# EAGLE design FindMe_Tag (EAGLE 9.0.1)

## Sheet 1 of 2
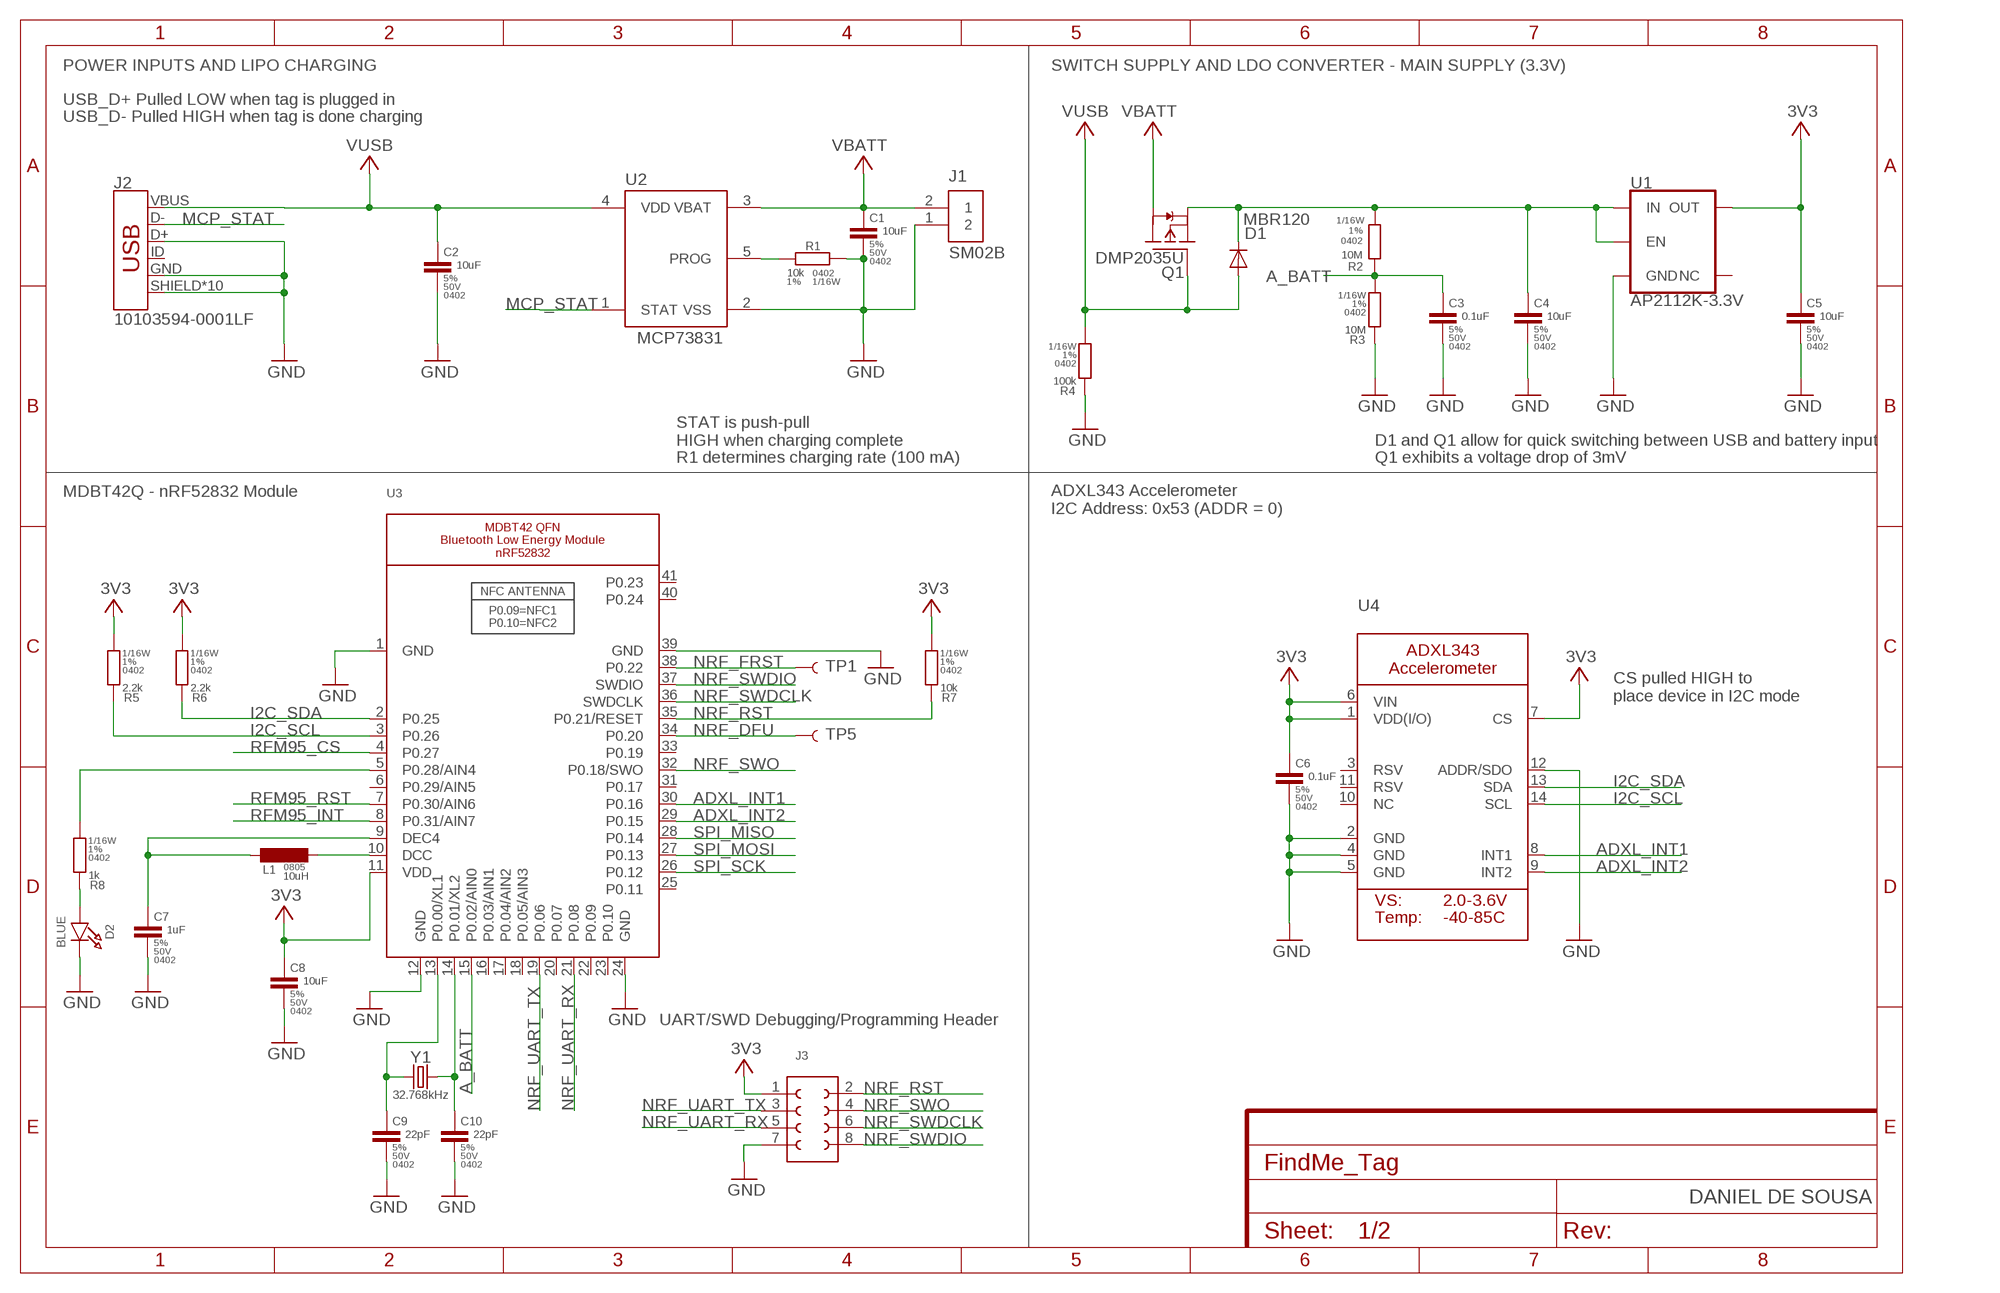
[diagram p0: schematic, sheet 1]

### Parts
C1  10uF  C-EUC0402_MURATA_GRM15-GJM15  [C0402_MURATA_GRM15-GJM15]
C2  10uF  C-EUC0402_MURATA_GRM15-GJM15  [C0402_MURATA_GRM15-GJM15]
C3  0.1uF  C-EUC0402_MURATA_GRM15-GJM15  [C0402_MURATA_GRM15-GJM15]
C4  10uF  C-EUC0402_MURATA_GRM15-GJM15  [C0402_MURATA_GRM15-GJM15]
C5  10uF  C-EUC0402_MURATA_GRM15-GJM15  [C0402_MURATA_GRM15-GJM15]
C6  0.1uF  C-EUC0402_MURATA_GRM15-GJM15  [C0402_MURATA_GRM15-GJM15]
C7  1uF  C-EUC0402_MURATA_GRM15-GJM15  [C0402_MURATA_GRM15-GJM15]
C8  10uF  C-EUC0402_MURATA_GRM15-GJM15  [C0402_MURATA_GRM15-GJM15]
C9  22pF  C-EUC0402_MURATA_GRM15-GJM15  [C0402_MURATA_GRM15-GJM15]
C10  22pF  C-EUC0402_MURATA_GRM15-GJM15  [C0402_MURATA_GRM15-GJM15]
D1  MBR120  AS-ITM-00111  [SOD-123FL]
D2  BLUE  LED0805_NOOUTLINE  [CHIPLED_0805_NOOUTLINE]
J1  SM02B  AS-ITM-00231  [JST_SH_2X1]
J2  10103594-0001LF  USB_MICRO-B_HALF_PTH_MILL  [USB-MICROB-PTH-MILL]
J3  610X08243021  [610X08243021]
L1  10uH  LQM21PN1R0MC0D  [L0805_MURATA_LQM21]
Q1  DMP2035U  AS-ITM-00024  [SOT23]
R1  10k  CRCW040210K0FKED  [R0402_VISHAY_CRCW0402]
R2  10M  CRCW04021M00FKED  [R0402_VISHAY_CRCW0402]
R3  10M  CRCW04021M00FKED  [R0402_VISHAY_CRCW0402]
R4  100k  CRCW04021M00FKED  [R0402_VISHAY_CRCW0402]
R5  2.2k  CRCW040210K0FKED  [R0402_VISHAY_CRCW0402]
R6  2.2k  CRCW040210K0FKED  [R0402_VISHAY_CRCW0402]
R7  10k  CRCW040210K0FKED  [R0402_VISHAY_CRCW0402]
R8  1k  CRCW040210K0FKED  [R0402_VISHAY_CRCW0402]
TP1  TEST-POINT3  [PAD.03X.03]
TP5  TEST-POINT3  [PAD.03X.03]
U1  AP2112K-3.3V  V_REG_AP2112K-3.3V  [SOT23-5]
U2  MCP73831  AS-ITM-00136  [SOT-23]
U3  NRF52832_MODULE_MDBT42  [BLE_MODULE_RAYTAC_MDBT42]
U4  ACCEL_ADXL343  [LGA14]
Y1  32.768kHz  CRYSTAL-32.768KHZSMD-3.2X1.5  [CRYSTAL-SMD-3.2X1.5MM]

### Nets
+3V3: C5.1 C6.1 C8.1 J3.1 R5.2 R6.2 R7.2 U1.5(OUT) U3.11(VDD) U4.1(VDD(I/O)) U4.6(VIN) U4.7(CS) ; supply symbol labelled 3V3 ; also sheet 2
A_BATT: C3.1 R2.1 R3.2 U3.15(P0.02/AIN0)
ADXL_INT1: U3.30(P0.16) U4.8(INT1)
ADXL_INT2: U3.29(P0.15) U4.9(INT2)
GND: C1.2 C2.2 C3.2 C4.2 C5.2 C6.2 C7.2 C8.2 C9.2 C10.2 D2.C J1.1 J2.D+ J2.GND J2.SHIELD J2.SHIELD2(SHIELD) J2.SHIELD3(SHIELD) J2.SHIELD4(SHIELD) J2.SHIELD5(SHIELD) J2.SHIELD6(SHIELD) J2.SHIELD7(SHIELD) J2.SHIELD8(SHIELD) J2.SHIELD9(SHIELD) J2.SHIELD10(SHIELD) J3.7 R1.1 R3.1 R4.1 U1.2(GND) U2.2(VSS) U3.1(GND) U3.12(GND) U3.24(GND) U3.39(GND) U4.2(GND) U4.4(GND) U4.5(GND) U4.12(ADDR/SDO) ; also sheet 2
I2C_SCL: R5.1 U3.3(P0.26) U4.14(SCL) ; also sheet 2
I2C_SDA: R6.1 U3.2(P0.25) U4.13(SDA) ; also sheet 2
MCP_STAT: J2.D- U2.1(STAT)
N$2: R1.2 U2.5(PROG)
N$3: C4.1 D1.C Q1.E(S) R2.2 U1.1(IN) U1.3(EN)
N$5: C9.1 U3.13(P0.00/XL1) Y1.P$1
N$6: C10.1 U3.14(P0.01/XL2) Y1.P$2
N$7: L1.P$2 U3.10(DCC)
N$11: C7.1 L1.P$1 U3.9(DEC4)
N$12: R8.2 U3.5(P0.28/AIN4)
N$18: D2.A R8.1
NRF_DFU: TP5.P$1 U3.34(P0.20)
NRF_FRST: TP1.P$1 U3.38(P0.22)
NRF_RST: J3.2 R7.1 U3.35(P0.21/RESET)
NRF_SWDCLK: J3.6 U3.36(SWDCLK)
NRF_SWDIO: J3.8 U3.37(SWDIO)
NRF_SWO: J3.4 U3.32(P0.18/SWO)
NRF_UART_RX: J3.5 U3.21(P0.08)
NRF_UART_TX: J3.3 U3.19(P0.06)
RFM95_CS: U3.4(P0.27) ; also sheet 2
RFM95_INT: U3.8(P0.31/AIN7) ; also sheet 2
RFM95_RST: U3.7(P0.30/AIN6) ; also sheet 2
SPI_MISO: U3.28(P0.14) ; also sheet 2
SPI_MOSI: U3.27(P0.13) ; also sheet 2
SPI_SCK: U3.26(P0.12) ; also sheet 2
VBATT: C1.1 J1.2 Q1.C(D) U2.3(VBAT)
VUSB: C2.1 D1.A J2.VBUS Q1.B(G) R4.2 U2.4(VDD)
Unconnected: J2.ID U1.4(NC) U3.6(P0.29/AIN5) U3.16(P0.03/AIN1) U3.17(P0.04/AIN2) U3.18(P0.05/AIN3) U3.20(P0.07) U3.22(P0.09) U3.23(P0.10) U3.25(P0.11) U3.31(P0.17) U3.33(P0.19) U3.40(P0.24) U3.41(P0.23) U4.3(RSV) U4.10(NC) U4.11(RSV)

### Notes on the sheet
- POWER INPUTS AND LIPO CHARGING | SWITCH SUPPLY AND LDO CONVERTER - MAIN SUPPLY (3.3V)
- USB_D+ Pulled LOW when tag is plugged in
- USB_D- Pulled HIGH when tag is done charging
- STAT is push-pull
  HIGH when charging complete
- D1 and Q1 allow for quick switching between USB and battery input
- R1 determines charging rate (100 mA) | Q1 exhibits a voltage drop of 3mV
- MDBT42Q - nRF52832 Module
- ADXL343 Accelerometer
  I2C Address: 0x53 (ADDR = 0)
- CS pulled HIGH to 
  place device in I2C mode
- UART/SWD Debugging/Programming Header
- DANIEL DE SOUSA

## Sheet 2 of 2
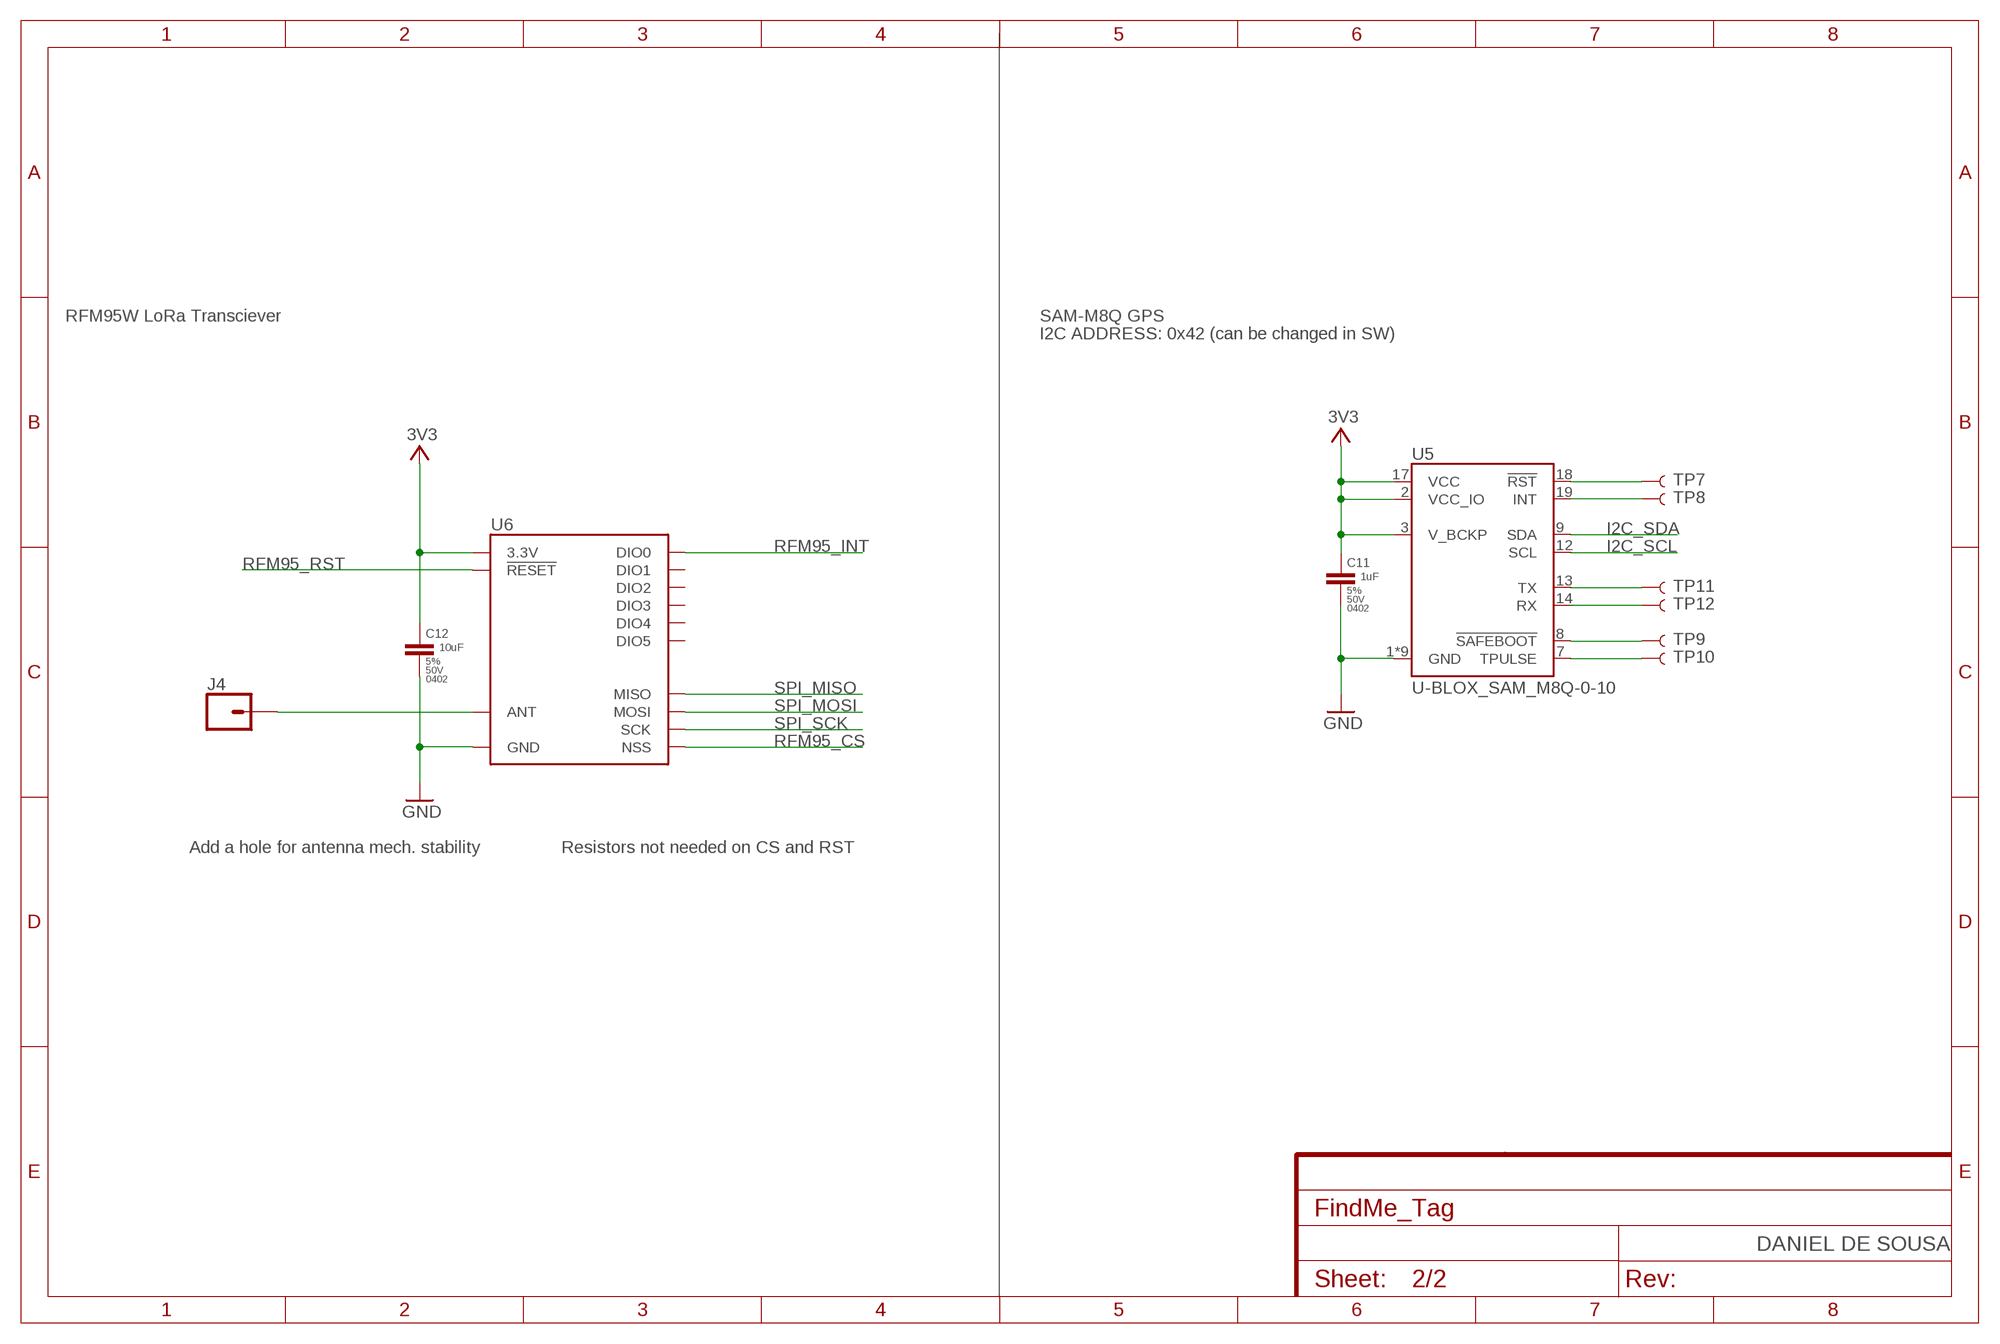
[diagram p1: schematic, sheet 2]

### Parts
C11  1uF  C-EUC0402_MURATA_GRM15-GJM15  [C0402_MURATA_GRM15-GJM15]
C12  10uF  C-EUC0402_MURATA_GRM15-GJM15  [C0402_MURATA_GRM15-GJM15]
J4  CONN_01PTH_NO_SILK_YES_STOP  [1X01_NO_SILK]
TP7  TEST-POINT3  [PAD.03X.03]
TP8  TEST-POINT3  [PAD.03X.03]
TP9  TEST-POINT3  [PAD.03X.03]
TP10  TEST-POINT3  [PAD.03X.03]
TP11  TEST-POINT3  [PAD.03X.03]
TP12  TEST-POINT3  [PAD.03X.03]
U5  U-BLOX_SAM_M8Q-0-10  [SAM-M8Q]
U6  RFM95W  [RFM95/96/97/98W]

### Nets
+3V3: C11.1 C12.1 U5.2(VCC_IO) U5.3(V_BCKP) U5.17(VCC) U6.3.3V ; supply symbol labelled 3V3 ; also sheet 1
GND: C11.2 C12.2 U5.1(GND) U5.4(GND) U5.5(GND) U5.6(GND) U5.10(GND) U5.11(GND) U5.15(GND) U5.16(GND) U5.20(GND) U6.GND@1(GND) U6.GND@2(GND) U6.GND@3(GND) ; also sheet 1
I2C_SCL: U5.12(SCL) ; also sheet 1
I2C_SDA: U5.9(SDA) ; also sheet 1
N$1: J4.1 U6.ANT
N$4: TP7.P$1 U5.18(!RST)
N$8: TP8.P$1 U5.19(INT)
N$9: TP9.P$1 U5.8(!SAFEBOOT)
N$10: TP10.P$1 U5.7(TPULSE)
N$13: TP11.P$1 U5.13(TX)
N$14: TP12.P$1 U5.14(RX)
RFM95_CS: U6.NSS ; also sheet 1
RFM95_INT: U6.DIO0 ; also sheet 1
RFM95_RST: U6.!RESET ; also sheet 1
SPI_MISO: U6.MISO ; also sheet 1
SPI_MOSI: U6.MOSI ; also sheet 1
SPI_SCK: U6.SCK ; also sheet 1
Unconnected: U6.DIO1 U6.DIO2 U6.DIO3 U6.DIO4 U6.DIO5

### Notes on the sheet
- RFM95W LoRa Transciever | SAM-M8Q GPS
- I2C ADDRESS: 0x42 (can be changed in SW)
- Add a hole for antenna mech. stability | Resistors not needed on CS and RST
- DANIEL DE SOUSA

## Library data of the parts
C1-C12 = CAPACITOR:C-EU: CAPACITOR, European symbol; PACKAGE: 0402; RATING: 50V; TOLERANCE: 5%
D1 = tinycircuits:AS-ITM-00111: DIODE SCHOTTKY 20V 1A SOD123L; PARTNO: AS-ITM-00111; PNPROTATION: 0; VALUE: MBR120VLSFT1G
D2 = microbuilder:LED: LED 0603 - 0603 Surface Mount Package 2mA: Green LED - Low Power (3.9mcd, 2ma, 1.7Vf) - Digikey: 475-2709-2-ND Orange LED - Low Power (9.8mcd, 2ma, 1.8Vf) - Digikey: 475-1194-2-ND Red LED - Low Power (5mcd, 2ma, 1.8Vf) - Digikey: 475-1195-2-ND Yellow LED - Low Power (7mcd, 2ma, 1.8Vf) - Digikey: 475-1196-2-ND 5mA: Blue LED - Low Power (17mcd, 5ma, 2.9Vf) - Digikey: LNJ937W8CRACT-ND 0805 - 0805 Surface Mount Package 2mA: Red LED (8.8mcd, 2mA, 1.8Vf, Clear) - Low Power [Digikey: 475-2510-1-ND] Green LED (5mcd, 2mA, 1.8Vf, Clear) - Low Power [Digikey: 475-2730-1-ND] Yellow LED (11.3mcd, 2mA, 1.8Vf, Clear) - Low Power [Digikey: 475-2555-1-ND] 20mA: Red LED (104mcd, 20mA, Diffused) - LS R976 [Digikey: 475-1278-6-ND] Red LED (12mcd, 20mA, 2.0Vf, Clear) - APT2012EC [Digikey: 754-1128-1-ND] Green LED (15mcd, 20mA, 2.2Vf, Clear) - APT2012GC [Digikey: 754-1131-1-ND] Orange LED (160mcd, 20mA, 2.1Vf, Clear) - APT2012SECK [Digikey: 754-1130-1-ND] 1206 - 1206 Surface Mount Package Green LED (26mcd, 20mA, Diffused) - LG N971 [Digikey: 475-1407-6-ND] Red LED (15mcd, 20mA, Diffused) - LH N974 [Digikey: 475-1416-6-ND] Cree - Cree High-Power Surface Mount LEDs XPEBWT-L1-0000-00D50 - White 111lm 350mA 2.9Vf 6200K 110° XTEAWT-00-0000-00000LEE3 - White 114lm 350mA 2.85Vf 5000K 115° Everlight - Everlight 45-21 Series Surface Mount LEDs 45-21/QK2C-B2832AC2CB2/2T - Warm White 2000mcd 20mA 3.25Vf 3050K 120° 45-21/LK2C-B38452C4CB2/2T - Nuetral White 2000mcd 20mA 3.25Vf 4150K 120° 45-21/LK2C-B50634C6CB2/2T - Cold White 2200mcd 20mA 3.25Vf 5650K 120° PLCC2 Reverse Mount LS T77K-J1L2-1-0-2-R18-Z - Red 11.25mcd 2mA 1.8Vf 630nm 120° LO T77K-L1M2-24-Z - Orange 19.6mcd 2mA 1.8Vf 606nm 120° LY T77K-K2M1-26-Z - Yellow 15.7mcd 2mA 1.8Vf 587nm 120°
J1 = tinycircuits:AS-ITM-00231: CONN HEADER SH 2POS SIDE 1MM; PARTNO: AS-ITM-00231; PNPROTATION: 180; VALUE: SM02B-SRSS-TB(LF)(SN)
J2 = SparkFun-Connectors:USB_MICRO-B: USB Type Micro-B Connector Male/female and PTH/SMT variants SparkFun Products: SparkFun microB USB Breakout <https://www.sparkfun.com/products/12035> SparkFun USB microB Plug Breakout <https://www.sparkfun.com/products/10031> SparkFun ESP8266 Thing <https://www.sparkfun.com/products/13231>; PROD_ID: CONN-13711
J3 = Board-to-Board (rev18a):610X08243021: WR-PHD 2.54mm SMT Dual Socket Header Bottom Entry, 8 Pins=>Code : Con_BTB_SHD_2.54_2_610x08243021(packageing:x = 0: Tube x = 3: Tape & Reel with Cap) <http://katalog.we-online.de/media/images/eican/Con_BTB_SHD_2.54_2_6100xx243021_pf2.jpg> Details see: 6100xx243021 http://katalog.we-online.de/en/em/PHD_2_54_SMT_DUAL_SOCKET_HEADER_BOTTOM_ENTRY_6100XX243021 6103xx243021 http://katalog.we-online.de/en/em/PHD_2_54_SMT_DUAL_SOCKET_HEADER_BOTTOM_ENTRY_6103XX243021 2014 (C) Würth Elektronik
J4 = SparkFun-Connectors:CONN_01: Single connection point. Often used as Generic Header-pin footprint for 0.1 inch spaced/style header connections On any of the 0.1 inch spaced packages, you can populate with these: Break Away Headers - Straight <https://www.sparkfun.com/products/116> (PRT-00116) Break Away Male Headers - Right Angle <https://www.sparkfun.com/products/553> (PRT-00553) Female Headers <https://www.sparkfun.com/products/115> (PRT-00115) Break Away Headers - Machine Pin <https://www.sparkfun.com/products/117> (PRT-00117) Break Away Female Headers - Swiss Machine Pin <https://www.sparkfun.com/products/743> (PRT-00743) This device is also useful as a general connection point to wire up your design to another part of your project. Our various solder wires solder well into these plated through hole pads. Hook-Up Wire - Assortment (Stranded, 22 AWG) <https://www.sparkfun.com/products/11375> (PRT-11375) Hook-Up Wire - Assortment (Solid Core, 22 AWG) <https://www.sparkfun.com/products/11367> (PRT-11367) View the entire wire category on our website here <https://www.sparkfun.com/categories/141> Special notes: SMTSO-256-ET is a "flush mount" nut for a 4-40 screw. We mostly use this on specialty testbeds; it is a nice way to connect hardware to your PCB at an adjustable hieght. Also note, the SNAP packages are for using a snappable style connector. We sell a baggie of snaps and they are also used on two LilyPad designs: Snap Assortment - 30 pack (male and female) <https://www.sparkfun.com/products/11347> (DEV-11347) LilyPad Arduino SimpleSnap <https://www.sparkfun.com/products/10941> (DEV-10941) LilyPad SimpleSnap Protoboard <https://www.sparkfun.com/products/10940> (DEV-10940)
L1 = INDUCTOR:LQM21PN1R0MC0D; PACKAGE: 0805; RATING: 800mA; TOLERANCE: 20%; VALUE: 1uH
Q1 = tinycircuits:AS-ITM-00024: P-Channel MOSFET SOT-23; PARTNO: AS-ITM-00024; PNPROTATION: 0
R1 R7 = RESISTOR:CRCW040210K0FKED; PACKAGE: 0402; RATING: 1/16W; TOLERANCE: 1%
R2-R4 = RESISTOR:CRCW04021M00FKED; PACKAGE: 0402; RATING: 1/16W; TOLERANCE: 1%; VALUE: 1M
R5 R6 R8 = RESISTOR:CRCW040210K0FKED; PACKAGE: 0402; RATING: 1/16W; TOLERANCE: 1%; VALUE: 10k
TP1 TP5 TP7-TP12 = SparkFun-Connectors:TEST-POINT: SparkFun Test Points Bare copper test points for troubleshooting or In-Circuit-Testing. These are used by our Production team for verifying production board runs using pogo-pins on test beds. SparkFun Products: SparkFun LSM9DS1 Breakout <https://www.sparkfun.com/products/13284> SparkFun PSOC <https://www.sparkfun.com/products/13714> SparkFun Load Cell Amplifier <https://www.sparkfun.com/products/13879>
U1 = SparkFun-IC-Power:V_REG_AP2112: AP2112 - 600mA CMOS LDO Regulator w/ Enable The AP2112 is CMOS process low dropout linear regulator with enable function, the regulator delivers a guaranteed 600mA (min.) continuous load current. Features Output Voltage Accuracy: ±1.5% Output Current: 600mA (Min.) Foldback Short Current Protection: 50mA Enable Function to Turn ON/OFF VOUT Low Dropout Voltage (3.3V): 250mV (Typ.) @IOUT=600mA Excellent Load Regulation: 0.2%/A (Typ.) Excellent Line Regulation: 0.02%/V (Typ.) Low Quiescent Current: 55μA (Typ.) Low Standby Current: 0.01μA (Typ.) Low Output Noise: 50μVRMS PSRR: 100Hz -65dB, 1kHz -65dB OTSD Protection Stable with 1.0μF Flexible Cap: Ceramic, Tantalum and Aluminum Electrolytic Operation Temperature Range: -40°C to 85°C ESD: MM 400V, HBM 4000V; PROD_ID: VREG-12457; VALUE: 3.3V
U2 = tinycircuits:AS-ITM-00136: IC CONTROLLER LI-ION 4.2V SOT23-5; PARTNO: AS-ITM-00136; PNPROTATION: 270
U3 = nRF52832:NRF52832_MODULE_MDBT42: MDBT42 - BLE Module (nRF52832 QFN) VDD: 1.7-3.6V
U4 = ADXL343 Rev B:ACCEL_ADXL343: ADXL343 - Digital Accelerometer 2/4/8/16g
U5 = SparkFun-GPS:U-BLOX_SAM_M8Q-0-10: u-blox SAM-M8Q The u-blox concurrent SAM-M8Q GNSS patch antenna module benefits from the exceptional performance of the u-blox M8 multi-GNSS engine. The SAM-M8Q module offers high sensitivity and minimal acquisition times in an ultra compact form factor. The SAM-M8Q module utilizes concurrent reception of up to three GNSS systems (GPS/Galileo and GLONASS), recognizes multiple constellations simultaneously and provides outstanding positioning accuracy in scenarios where urban canyon or weak signals are involved. For even better and faster positioning improvement, the SAM-M8Q supports augmentation of QZSS, GAGAN and IMES together with WAAS, EGNOS, MSAS. The SAM-M8Q also supports message integrity protection, geofencing, and spoofing detection with configurable interface settings to easily fit to customer applications.; PROD_ID: IC-14070
U6 = SparkFun-RF:RFM95W: RFM95/96/97/98 The RFM95/96/97/98(W) transceivers feature the LoRaTM long range modem that provides ultra-long range spread spectrum communication and high interference immunity whilst minimising current consumption. These devices also support high performance (G)FSK modes for systems including WMBus, IEEE802.15.4g. The RFM95/96/97/98(W) deliver exceptional phase noise, selectivity, receiver linearity and IIP3 for significantly lower current consumption than competing devices Datasheet <http://www.hoperf.com/upload/rf/RFM95_96_97_98W.pdf>; PROD_ID: IC-13959
Y1 = SparkFun-Clocks:CRYSTAL-32.768KHZ: 32.768kHz Crystal Frequency: 32.768kHz Frequency Stability: ±20ppm Load Capacitance: 12.5pF (PTH-2X6 & SMD-3.2X1.5), 6pF (SMD-2X6) SparkFun Products: SparkFun BigTime Watch Kit <https://www.sparkfun.com/products/11734> SparkFun nRF52832 Breakout <https://www.sparkfun.com/products/13990> SparkFun Real Time Clock Module <https://www.sparkfun.com/products/12708>; PROD_ID: XTAL-13062

## Board
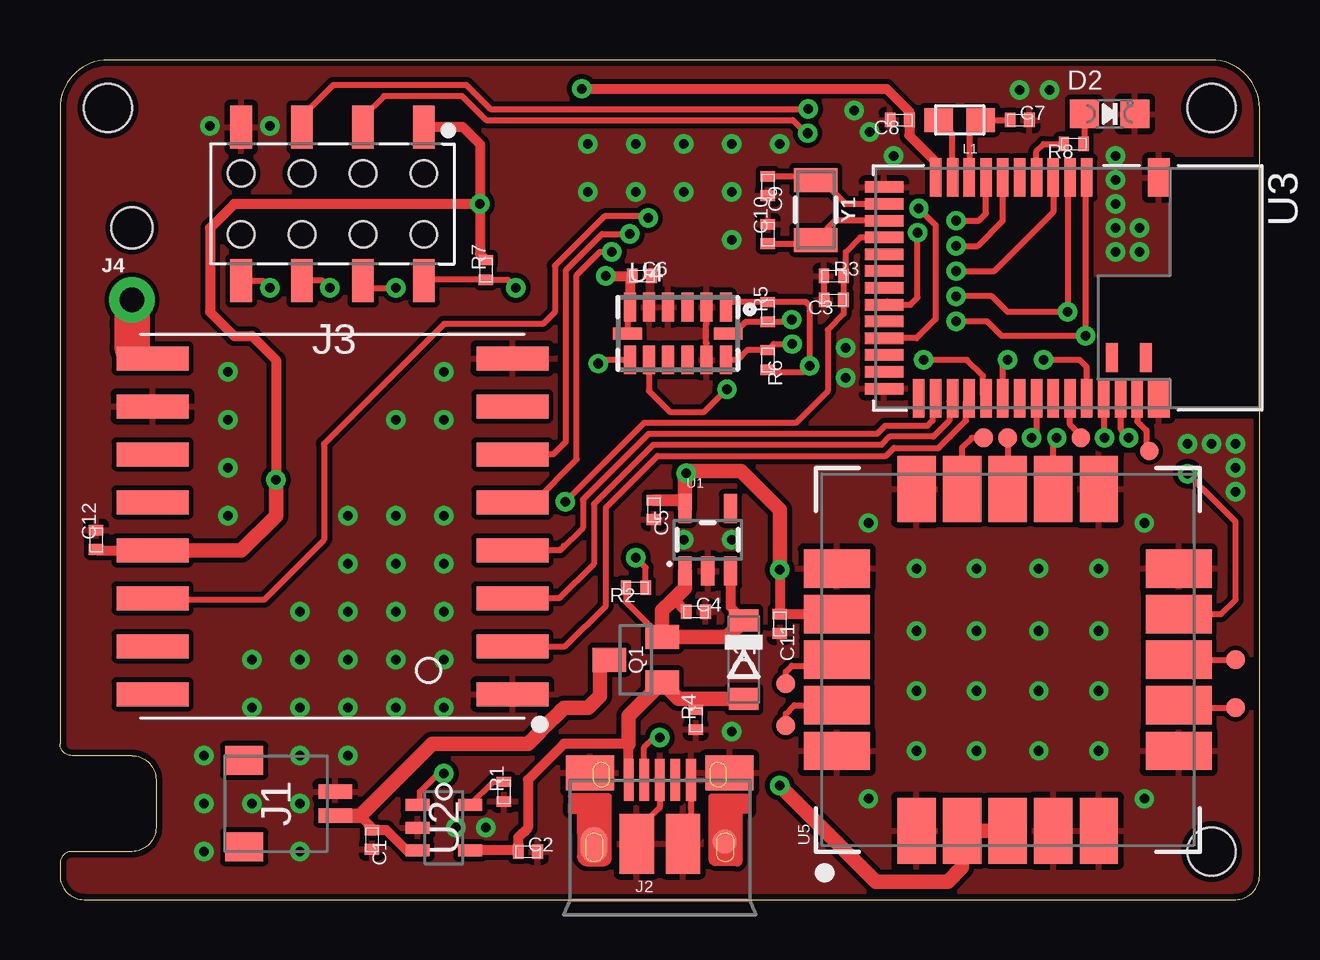
[diagram p2: board, top side]
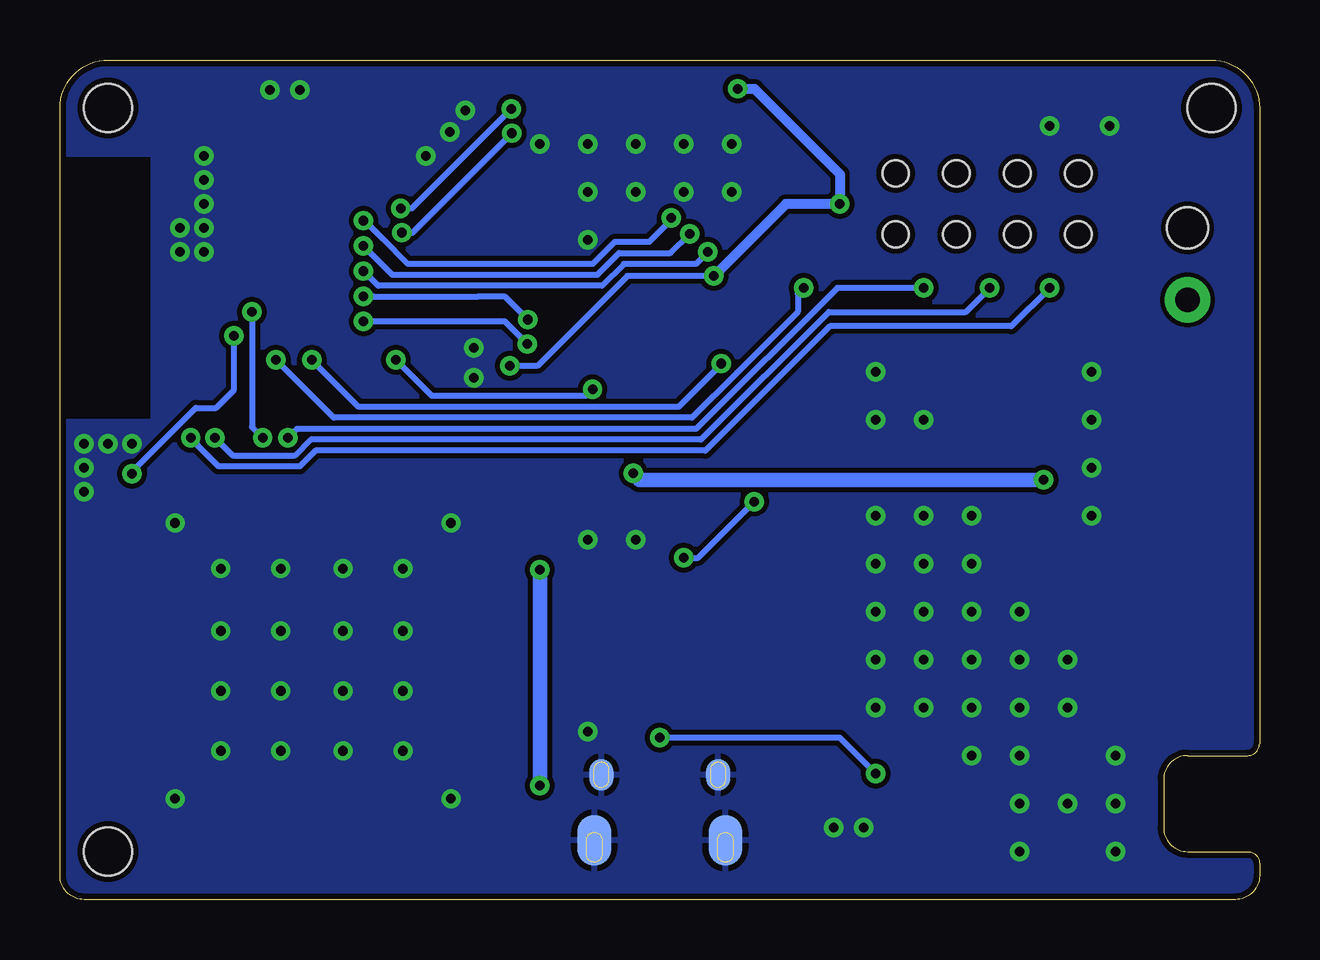
[diagram p3: board, bottom side, seen from below]

Size 50 x 35 mm. Coordinates in mm from the lower left corner, seen from the top.
Outline: 50,1 50,33 arc90 48,35 2,35 arc90 0,33 0,6.5 arc90 0.5,6 3,6 arc-90 4,5 4,3 arc-90 3,2 0.5,2 arc90 0,1.5 0,1 arc90 1,0 49,0 arc90 50,1
Copper layers (1*16): Top 0.035mm / dielectric 1.5mm / Bottom 0.035mm
Design rules "drc": minimum track width 8mil, minimum drill 15.5mil, track to track 8mil, track to pad 8mil, pad to pad 8mil, via to via 8mil, smd to smd 8mil, copper to edge 10mil, drill to drill 8mil, minimum pad ring 10mil, minimum via ring 8mil, stop-mask expansion 2mil, vias tented up to drill 20mil, thermal gap 10mil
Holes 2 mm at 48,33 2,33 48,2
Holes 1.7 mm at 3,28

### Footprints (pad centres in the part's own frame; a part is rotated, then mirrored left to right if it is on the bottom)
C0402_MURATA_GRM15-GJM15 = smd 0.45 x 0.6: 1 -0.4,0; 2 0.4,0
SOD-123FL = smd 0.914 x 1.219: A 1.638,0; C -1.638,0
CHIPLED_0805_NOOUTLINE = smd 1.2 x 1.2: A 0,-1.05; C 0,1.05
JST_SH_2X1 = smd 0.6 x 1.4: 1 -0.5,2.475; 2 0.5,2.475 | smd 1.2 x 1.6: PAD1 -1.8,-1.325; PAD2 1.8,-1.325
USB-MICROB-PTH-MILL = smd 0.4 x 1.75: D+ 0,0; D- -0.65,0; GND 1.3,0; ID 0.65,0; VBUS -1.3,0 | smd 2 x 1.46: SHIELD -2.9,0.275; SHIELD2 2.9,0.275 | smd 1.425 x 2.5: SHIELD3 -0.963,-2.675; SHIELD4 0.963,-2.675 | smd 1.4 x 2.1 bottom: SHIELD5 -2.731,-2.531; SHIELD7 2.729,-2.531 | smd 1 x 1: SHIELD6 2.7,-2.575 | smd 1.1 x 1.5: SHIELD8 -2.731,-2.731 | smd 1 x 1.3 bottom: SHIELD9 -2.43,0.195; SHIELD10 2.43,0.195
610X08243021 = smd 0.9 x 1.8: 1 -3.81,-3.2; 2 -3.81,3.2; 3 -1.27,-3.2; 4 -1.27,3.2; 5 1.27,-3.2; 6 1.27,3.2; 7 3.81,-3.2; 8 3.81,3.2 | hole 1.1: -3.81,1.27; -1.27,1.27; -1.27,-1.27; -3.81,-1.27; 1.27,1.27; 1.27,-1.27; 3.81,1.27; 3.81,-1.27
1X01_NO_SILK = drill 1.016 pad 1.88: 1 0,0
L0805_MURATA_LQM21 = smd 1.2 x 1: P$1 -0.875,0; P$2 0.875,0
SOT23 = smd 1 x 1.4: B -0.95,-1.1; C 0,1.1; E 0.95,-1.1
R0402_VISHAY_CRCW0402 = smd 0.425 x 0.6: 1 -0.412,0; 2 0.412,0
PAD.03X.03 = smd 0.762 x 0.762: P$1 0,0
SOT23-5 = smd 0.55 x 1.2: 1 -0.95,-1.3; 2 0,-1.3; 3 0.95,-1.3; 4 0.95,1.3; 5 -0.95,1.3
SOT-23 = smd 0.5 x 1: 1 -0.95,-1.1; 2 0,-1.1; 3 0.95,-1.1; 4 0.95,1.1; 5 -0.95,1.1
BLE_MODULE_RAYTAC_MDBT42 = smd 1.6 x 0.9: 1 -4.6,3.8; 39 4.6,3.8 | smd 1.6 x 0.48: 2 -4.6,0.8; 3 -4.6,0.1; 4 -4.6,-0.6; 5 -4.6,-1.3; 6 -4.6,-2; 7 -4.6,-2.7; 8 -4.6,-3.4; 9 -4.6,-4.1; 10 -4.6,-4.8; 11 -4.6,-5.5; 25 4.6,-6.2; 26 4.6,-5.5; 27 4.6,-4.8; 28 4.6,-4.1; 29 4.6,-3.4; 30 4.6,-2.7; 31 4.6,-2; 32 4.6,-1.3; 33 4.6,-0.6; 34 4.6,0.1; 35 4.6,0.8; 36 4.6,1.5; 37 4.6,2.2; 38 4.6,2.9 | smd 0.48 x 1.6: 12 -4.2,-7.65; 13 -3.5,-7.65; 14 -2.8,-7.65; 15 -2.1,-7.65; 16 -1.4,-7.65; 17 -0.7,-7.65; 18 0,-7.65; 19 0.7,-7.65; 20 1.4,-7.65; 21 2.1,-7.65; 22 2.8,-7.65; 23 3.5,-7.65; 24 4.2,-7.65 | smd 1.2 x 0.5: 40 2.9,3.25; 41 2.9,1.85
LGA14 = smd 0.5 x 1.2: 1 2,1.1; 2 1.2,1.1; 3 0.4,1.1; 4 -0.4,1.1; 5 -1.2,1.1; 6 -2,1.1; 8 -2,-1.1; 9 -1.2,-1.1; 10 -0.4,-1.1; 11 0.4,-1.1; 12 1.2,-1.1; 13 2,-1.1 | smd 1.2 x 0.5: 7 -2.1,0; 14 2.1,0
SAM-M8Q = smd 2.75 x 1.6: 1 -7.125,3.8; 2 -7.125,1.9; 3 -7.125,0; 4 -7.125,-1.9; 5 -7.125,-3.8; 11 7.125,-3.8; 12 7.125,-1.9; 13 7.125,0; 14 7.125,1.9; 15 7.125,3.8 | smd 1.6 x 2.75: 6 -3.8,-7.125; 7 -1.9,-7.125; 8 0,-7.125; 9 1.9,-7.125; 10 3.8,-7.125; 16 3.8,7.125; 17 1.9,7.125; 18 0,7.125; 19 -1.9,7.125; 20 -3.8,7.125
RFM95/96/97/98W = smd 3 x 1: 3.3V 7.5,1; !RESET -7.5,-3; ANT 7.5,-7; DIO0 7.5,3; DIO1 7.5,5; DIO2 7.5,7; DIO3 7.5,-3; DIO4 7.5,-1; DIO5 -7.5,-5; GND@1 -7.5,7; GND@2 -7.5,-7; GND@3 7.5,-5; MISO -7.5,5; MOSI -7.5,3; NSS -7.5,-1; SCK -7.5,1
CRYSTAL-SMD-3.2X1.5MM = smd 1 x 1.8: P$1 -1.25,0; P$2 1.25,0

### Placement (x,y rotation side)
C1  13,2.5 270 top
C2  19.5,2 0 top
C3  32.25,25 180 top
C4  26.5,12 0 top
C5  24.75,16.25 270 top
C6  24.25,26 0 top
C7  40,32.5 0 top
C8  35,32.5 180 top
C9  29.5,29.75 270 top
C10  29.5,27.75 90 top
C11  30,11.5 270 top
C12  1.5,15 90 top
D1  28.5,10 270 top
D2  43.75,32.75 270 top
J1  9,4 270 top
J2  25,5 0 top
J3  11.36,29 180 top
J4  3,25 0 top
L1  37.5,32.5 180 top
Q1  24,10 90 top
R1  18.5,4.5 90 top
R2  24,13 180 top
R3  32.25,26 0 top
R4  26.5,7.5 90 top
R5  29.5,24.5 90 top
R6  29.5,22.5 270 top
R7  17.75,26.25 90 top
R8  42.25,31.5 180 top
TP1  45.4,18.7 0 top
TP5  42.55,19.25 0 top
TP7  30.25,9 0 top
TP8  30.25,7.25 0 top
TP9  49,10 0 top
TP10  49,8 0 top
TP11  39.5,19.25 0 top
TP12  38.5,19.25 0 top
U1  27,15 0 top
U2  16,3 270 top
U3  42,25.5 270 top
U4  25.75,23.6 0 top
U5  39.5,10 90 top
U6  11.36,15.56 180 top
Y1  31.5,28.75 270 top

### Tracks (layer width: path | path; a pad name or v marks a point on that pad's centre or on a via)
+3V3  (via drill 0.4)
  Top 0.254: 36.5,30 U3.11 36.5,30.25 | U4.6 23.65,24.5 U4.7 | R6.2 29.59,22 31,22 v31.25,22.25 31.25,24.75 31.09,24.91 R5.2 27.96,24.91 U4.1
  Top 0.406: C12.1 1.54,14.56 3.5,14.56 U6.3.3V 7.5,14.56 | v30,13.75 C11.1 U5.17 | 37.6,1.6 U5.2 | v17.5,29 17.5,31.5 16.8,32.2 J3.1 | 36.5,30.25 36.5,30.75 35.4,31.85 C8.1 35.4,32.85 34.45,33.8 v21.75,33.8 | v22.75,26 C6.1 23.75,25.9 U4.6 | R7.2 17.5,26.91 v17.5,29 | v17.5,29 7.25,29 6.25,28 6.25,24.5 7.25,23.5 8,23.5 9,22.5 v9,17.5
  Top 0.508: C5.1 26,16.65 26.05,16.7
  Top 0.61: v30,13.75 30,16.25 28.39,17.86 26.2,17.86 v26.1,17.77 26.05,17.72 26.05,16.7 U1.5 | 3.5,14.56 7.5,14.56 7.56,14.56 9,16 v9,17.5 | U5.3 U5.2 37.6,1.35 37,0.75 34,0.75 v30,4.75
  Bottom 0.254: v22.75,26 26.35,26 30.1,22.25 v31.25,22.25
  Bottom 0.406: v22.75,26 19.75,29 v17.5,29 17.5,30.25 21.05,33.8 v21.75,33.8
  Bottom 0.61: v30,13.75 v30,4.75 | v26.1,17.77 25.83,17.5 v9,17.5
A_BATT  (via drill 0.4)
  Top 0.254: R2.1 24.41,13.84 v24,14.25 | U3.15 33.35,27.6 32.75,27 32.75,26.09 R3.2 32.66,25.01 | 32.66,25.01 C3.1 | 32.66,25.01 32.66,24.41 32,23.75 32,21.2 30.67,19.87 24.35,19.87 21.34,16.86 | 21.34,16.86 21.33,16.86 | 21.34,16.86 v21.06,16.59
  Bottom 0.254: v24,14.25 23.4,14.25 v21.06,16.59
ADXL_INT1  (via drill 0.4)
  Top 0.254: U3.30 39.3,22.3 v39.5,22.5 | v22.44,22.34 22.6,22.5 U4.8
  Bottom 0.254: v39.5,22.5 39.21,22.21 37.54,20.54 24.21,20.54 22.44,22.31 v22.44,22.34
ADXL_INT2  (via drill 0.4)
  Top 0.254: U4.9 24.55,21.2 25.42,20.33 26.85,20.33 v27.8,21.27 | U3.29 38.47,21.03 38.47,21.84 37.81,22.5 v36,22.5
  Bottom 0.254: v36,22.5 34.5,21 28.08,21 v27.8,21.27
GND  (via drill 0.4)
  Top 0.254: J2.GND 26.3,2.66 J2.SHIELD4 | J2.D+ 25,3.86 24.04,2.9 | U4.12 26.95,23.18 26.92,23.21 26.92,23.99 26.95,24.02 U4.2 | R3.1 31.85,25.99 C3.2
  Top 0.406: 24.04,3.04 24.04,2.9 J2.SHIELD3
  other vias: 35.7,13.8 35.7,11.2 35.7,8.7 35.7,6.2 38.2,13.8 40.8,13.8 43.3,13.8 38.2,11.2 40.8,11.2 43.3,11.2 38.2,8.7 40.8,8.7 43.3,8.7 38.2,6.2 40.8,6.2 43.3,6.2 44,27 45,27 44,28 45,28 44,29 44,30 44,31 47,19 48,19 40,33.75 41.25,33.75 33.75,32 32.75,21.75 32.75,23 34.75,31 17.75,3 16.5,3 28,7 26,15 28,15 49,19 49,18 49,17 33.1,32.9 8.75,32.25 6.25,32.25 7,20 7,22 16,22 16,20 14,20 7,18 16,10 14,10 14,12 16,12 7,16 14,8 16,8 6,2 6,4 6,6 8,4 10,4 10,2 10,6 12,6 12,12 10,12 10,10 8,10 8,8 10,8 12,8 12,10 16,14 16,16 14,16 12,16 12,14 14,14 22,31.5 24,31.5 26,31.5 28,31.5 26,29.5 24,29.5 22,29.5 28,29.5 28,27.5 30,31.5 33.7,4.2 45.2,4.2 45.2,15.7 33.7,15.7
  pour Top: -1,36 -1,-1 51,-1 51,36
  pour Bottom: -1,36 51,36 51,-1 -1,-1
I2C_SCL  (via drill 0.4)
  Top 0.254: 40.75,17.77 U5.12 41.4,19.1 v41.55,19.25 | U3.3 42,30 v42,24.5 39.5,24.5 38.85,25.15 v37.35,25.15 | U4.14 28.1,23.6 28.59,24.09 R5.1 30.25,24.09 30.34,24.18 v30.5,24.18
  Bottom 0.254: v41.55,19.25 42,19.7 v42,24.5 | v37.35,25.15 36.95,25.15 36.92,25.13 32.6,25.13 31.45,25.13 v30.5,24.18
I2C_SDA  (via drill 0.4)
  Top 0.254: U5.9 48.4,11.9 49,12.5 49,15.75 v47,17.75 | U3.2 42.75,30.05 v42.75,23.5 39.25,23.5 38.65,24.1 v37.35,24.1 | U4.13 28.25,22.5 28.66,22.91 R6.1 29.75,23.16 v30.52,23.16
  Bottom 0.254: v42.75,23.5 42.75,21.25 43.5,20.5 44.34,20.5 47,17.84 v47,17.75 | v30.52,23.16 31.46,24.1 36.5,24.1 v37.35,24.1
MCP_STAT  (via drill 0.4)
  Top 0.254: U2.1 15,4.05 15,4.5 15.75,5.25 v16,5.25 | J2.D- 24.35,6.35 24.75,6.75 v25,6.75
  Bottom 0.254: v16,5.25 17.5,6.75 v25,6.75
N$1
  Top 0.254: 3,24 3,23.42 U6.ANT
  Top 1.473: J4.1 3,24 3,23
N$2
  Top 0.254: U2.5 18.06,4.91 R1.2
N$3
  Top 0.254: R2.2 23.59,12.41 25.05,10.95
  Top 0.406: 25.05,10.95 Q1.E 27.5,10.95 | 26.05,12.05 C4.1 25.62,12.47 25.52,12.47 | U1.3 27.95,12.19 D1.C
  Top 0.61: D1.C 27.81,10.95 27.5,10.95 25.05,10.95 | U1.1 26.05,13 25.52,12.47 25.1,12.05 Q1.E
N$4
  Top 0.254: TP7.P$1 30.25,9.5 30.5,9.75 32.12,9.75 U5.18
N$5
  Top 0.254: Y1.P$1 31.35,29.9 31.75,29.9 | U3.13 32.75,29 31.85,29.9 31.75,29.9 | C9.1 31.5,30.15 31.75,29.9
N$6
  Top 0.254: U3.14 32.3,28.3 31.62,27.62 Y1.P$2 31.35,27.35 C10.1
N$7
  Top 0.254: U3.10 37.2,31.93 L1.P$2
N$8
  Top 0.254: TP8.P$1 30.25,7.75 30.6,8.1 U5.19
N$9
  Top 0.254: U5.8 TP9.P$1
N$10
  Top 0.254: U5.7 46.73,8 TP10.P$1
N$11
  Top 0.254: U3.9 37.9,32.02 L1.P$1 C7.1
N$12
  Top 0.254: U3.5 40.7,31.2 41,31.5 R8.2
N$13
  Top 0.254: TP11.P$1 U5.13
N$14
  Top 0.254: 37.5,17.23 U5.14 37.6,17.25 37.6,18.35 37.6,18.85 38,19.25 TP12.P$1
N$18
  Top 0.254: D2.A 42.7,31.54 R8.1
NRF_DFU
  Top 0.254: U3.34 42.23,20.77 42.1,20.64 42.1,19.8 42.55,19.35 TP5.P$1
NRF_FRST
  Top 0.254: 45.02,20.28 U3.38 44.9,19.93 45.28,19.55 45.28,18.82 TP1.P$1
NRF_RST  (via drill 0.4)
  Top 0.254: U3.35 42.8,22.2 42.5,22.5 v41,22.5 | 17.84,25.75 R7.1 | R7.1 15.21,25.84 J3.2 | R7.1 18.66,25.84 v19,25.5
  Bottom 0.254: 21.79,21.96 | 21.79,21.96 23.66,20.08 38.58,20.08 v41,22.5 | 21.79,21.96 19.25,24.5 19.25,25.25 v19,25.5
NRF_SWDCLK  (via drill 0.4)
  Top 0.254: v11.25,25.5 10.95,25.8 J3.6 | U3.36 43.5,19.29 v43.54,19.25
  Bottom 0.254: v11.25,25.5 12.25,24.5 17.95,24.5 23.29,19.17 39.54,19.17 40.2,18.52 42.81,18.52 v43.54,19.25
NRF_SWDIO  (via drill 0.4)
  Top 0.254: J3.8 8.45,25.8 v8.75,25.5 | U3.37 44.2,19.63 44.27,19.55 44.27,19.52 v44.55,19.25
  Bottom 0.254: v8.75,25.5 10.35,23.9 17.9,23.9 23.1,18.71 39.35,18.71 40.01,18.06 43.39,18.06 44.27,18.95 44.27,18.97 v44.55,19.25
NRF_SWO  (via drill 0.4)
  Top 0.254: J3.4 12.93,25.5 v14,25.5 | U3.32 40.7,19.45 v40.5,19.25
  Bottom 0.254: v40.5,19.25 40.12,19.63 23.47,19.63 17.6,25.5 v14,25.5
NRF_UART_RX  (via drill 0.4)
  Top 0.254: 10,32.75 10.09,32.66 | 10.09,32.66 J3.5 | U3.21 35.7,23.4 36.49,24.19 36.49,28.12 v35.8,28.81 | v31.19,32.96 17.94,32.96 16.94,33.96 11.39,33.96 10.09,32.66
  Bottom 0.254: v31.19,32.96 35.34,28.81 v35.8,28.81
NRF_UART_TX  (via drill 0.4)
  Top 0.254: J3.3 12.63,32.63 13.5,33.5 16.75,33.5 17.75,32.5 30.55,32.5 31.1,31.95 v31.16,31.95 | 34.48,24.93 U3.19 35.45,24.8 35.75,25.1 v35.75,27.79 v35.76,27.8
  Bottom 0.254: v31.16,31.95 35.31,27.8 v35.76,27.8
RFM95_CS  (via drill 0.4)
  Top 0.254: 19.81,16.56 19.75,16.56 | 19.75,16.56 U6.NSS | 19.75,16.56 21.54,18.35 21.54,26.04 22.5,27 v23,27 | 41.27,29.97 U3.4 41.4,28.65 38.95,26.2 v37.35,26.2
  Bottom 0.254: v23,27 23.5,26.5 26.5,26.5 27.42,25.58 36.73,25.58 v37.35,26.2
RFM95_INT  (via drill 0.4)
  Top 0.254: 3.25,12.5 3.8,12.5 | 3.8,12.5 U6.DIO0 | 3.8,12.5 8.5,12.5 11,15 11,19 16,24 20.13,24 20.63,24.5 20.63,26.42 22.69,28.48 24.44,28.48 v24.51,28.41 | v37.35,28.3 38.3,28.3 38.6,28.6 U3.8
  Bottom 0.254: 36.54,27.54 | 36.54,27.54 37.3,28.3 v37.35,28.3 | 36.54,27.54 35.5,26.5 27.79,26.5 26.88,27.41 25.44,27.41 24.51,28.34 v24.51,28.41
RFM95_RST  (via drill 0.4)
  Top 0.254: U6.!RESET 20.56,18.56 21.08,19.08 21.08,26.23 22.6,27.75 v23.75,27.75 | v37.35,27.25 38.25,27.25 39.3,28.3 U3.7
  Bottom 0.254: v23.75,27.75 24.54,26.96 26.69,26.96 27.61,26.04 36,26.04 36.04,26.04 36.14,26.04 v37.35,27.25
SPI_MISO
  Top 0.254: U3.28 37.77,20.77 37.77,19.96 37.1,19.3 36.64,18.84 36.64,18.83 34.76,18.83 34.43,18.5 24.91,18.5 22.75,16.34 22.75,12.25 21.06,10.56 U6.MISO
SPI_MOSI
  Top 0.254: U3.27 37.07,20.77 37.07,19.96 36.4,19.29 34.58,19.29 34.24,18.96 24.73,18.96 24.43,18.67 22.25,16.48 22.25,14 20.81,12.56 U6.MOSI
SPI_SCK
  Top 0.254: U3.26 36.37,20.77 36.37,19.96 36.16,19.75 34.39,19.75 34.05,19.41 24.54,19.41 21.79,16.67 21.79,15.5 20.85,14.56 U6.SCK 20.81,14.56 21,14.75
VBATT
  Top 0.406: 12.5,3.5 13,3 C1.1 13.6,2.9 14.45,2.05 U2.3
  Top 0.61: Q1.C 22.5,9.6 22.5,8.5 22,8 21,8 20.87,7.87 20.87,7.85 20.57,7.55 20.55,7.55 19.5,6.5 15.5,6.5 12.5,3.5 J1.2
VUSB
  Top 0.254: 26.5,8.36 R4.2
  Top 0.406: J2.VBUS 23.7,6.5 21,6.5 19.5,5 19.5,3 19.1,2.6 C2.1 19.05,2.05 U2.4 | 28.45,8.41 D1.A
  Top 0.61: 23.7,6.5 23.7,7.65 Q1.B 25.79,8.36 26.5,8.36 D1.A

### Text on the board
_tsilk: GND | nRF_RX | nRF_TX | 3V3 | C8 | L1 | D2 | C7 | R8 | C9 | J3 | R7 | C10 | Y1 | C6 | R5 | R3 | C3 | U3 | SWDIO | SWCLK | SWO | RST | U4 | R6 | U6 | C5 | U1 | C12 | R2 | C4 | C11 | Q1 | U5 | D1 | R4 | R1 | J1 | C1 | U2 | C2 | FindMe Tag | J2